# Altium schematic sheet CableNew.SchDoc
size A4
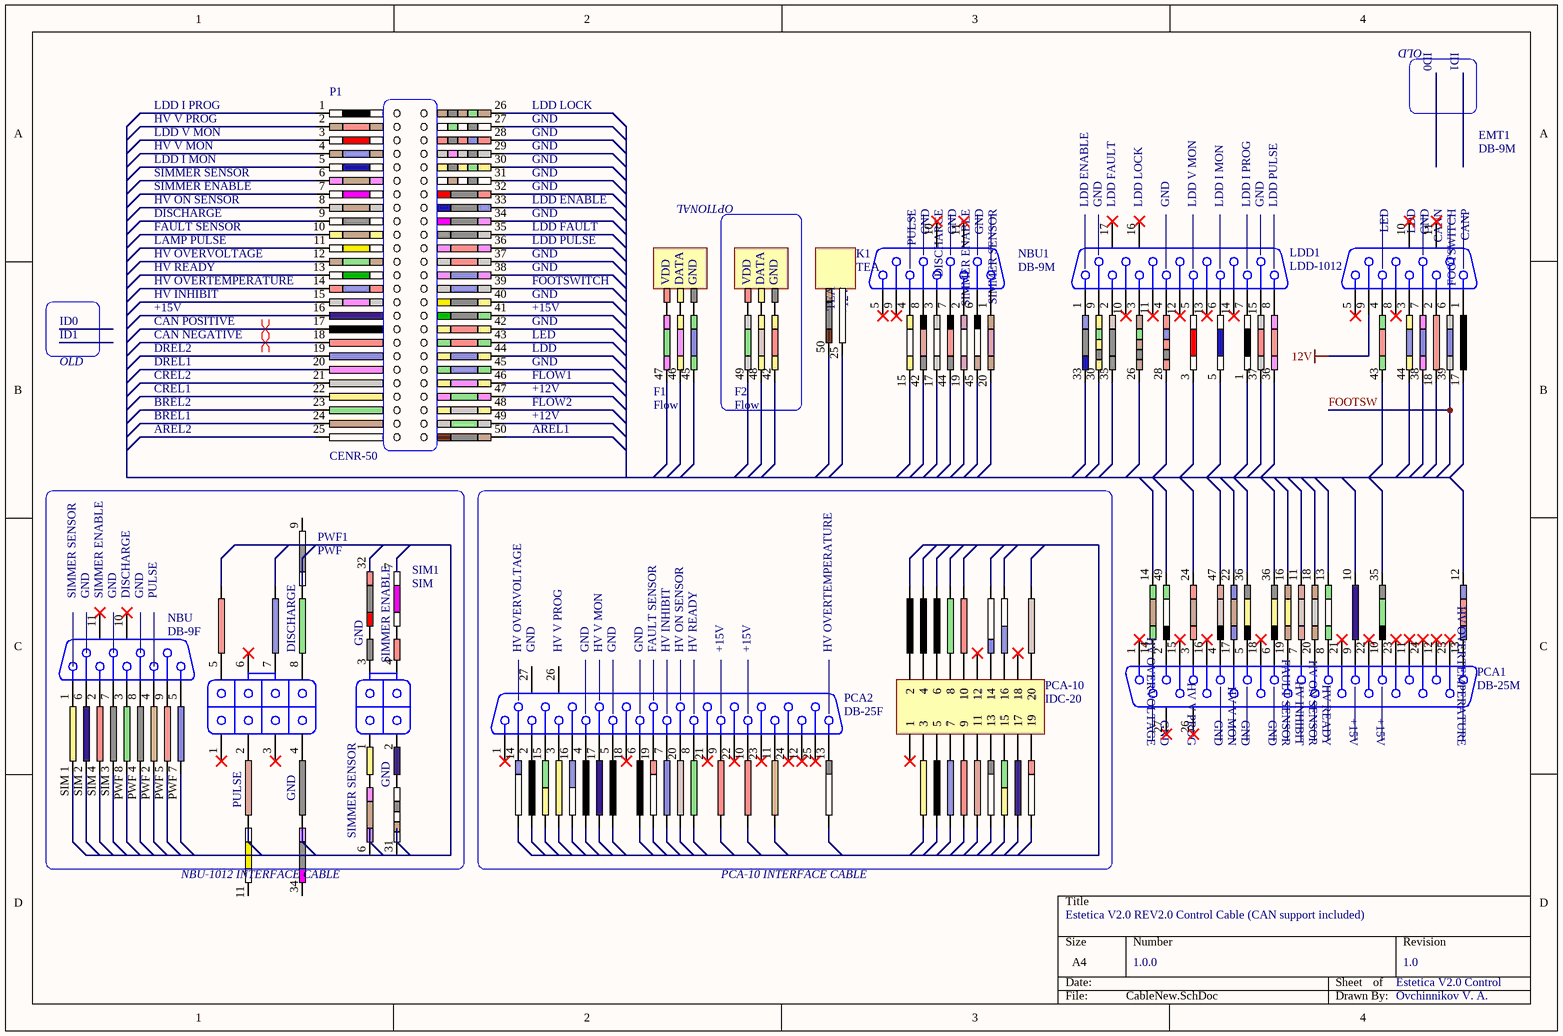
[diagram p0: CableNew.SchDoc]

## Parts
EMT1  DB-9M
F1  Flow
F2  Flow
K1  TEA
LDD1  LDD-1012
NBU  DB-9F
NBU1  DB-9M
P1  CENR-50
PCA1  DB-25M
PCA2  DB-25F
PCA-10  IDC-20
PWF1  PWF
SIM1  SIM

## Blocks framed on the sheet
OPTIONAL: F2

## Nets
12V: EMT1.9

Not connected (* = marked no-connect by the designer): EMT1 1 2 3 4 5* 6 7 8* 10(MH1)* 11(MH2)* 17 18 38 39 43 44; F1 45 46 47; F2 42 48 49; K1 25 50; LDD1 1 2 3 4 5 6 7 8 9 10* 11* 12* 13* 14* 15 16(MH1)* 17(MH2)* 26 28 30 33 35 36 37; NBU 1 2 3 4 5 6 7 8 9 10(MH1)* 11(MH2)* PWF 2 PWF 4 PWF 5 PWF 7 PWF 8 SIM 1 SIM 2 SIM 3 SIM 4; NBU1 1 2 3 4 5* 6 7 8 9* 10(MH1)* 11(MH2)* 15 17 19 20 42 44 45; P1 1 2 3 4 5 6 7 8 9 10 11 12 13 14 15 16 17 18 19 20 21 22 23 24 25 26 27 28 29 30 31 32 33 34 35 36 37 38 39 40 41 42 43 44 45 46 47 48 49 50; PCA1 1* 2 3 4 5 6 7 8 9 10 11 12 13 14 15* 16 17 18 19 20 21* 22 23* 24 25* 26(MH1)* 27(MH2)* 35 36 47 49; PCA2 1* 2 3 4 5 6 7 8 9 10 11 12* 13 14 15 16 17 18* 19 20 21* 22* 23* 24* 25* 26(MH1) 27(MH2) ?1 ?2 ?3 ?4 ?5 ?6 ?7 ?8 ?9 ?10 ?11 ?12 ?13 ?14 ?15 ?16 ?17; PCA-10 1* 2 3 4 5 6 7 8 9 10 11 12* 13 14 15 16 17 18* 19 20 ?1 ?2 ?3 ?4 ?5 ?6 ?7 ?8 ?9 ?10 ?11 ?12 ?13 ?14 ?15 ?16 ?17; PWF1 1* 2 3* 4 5 6* 7 8 9 11 34 ?1 ?2 ?3 ?4 ?5; SIM1 1 2 3 4 6 7 31 32 ?1 ?2 ?3 ?4

## Layout directives
differential pair: NetP1_17, NetP1_18

## Notes on the sheet
- OLD
- LDD I PROG
- (near P1) LDD LOCK
- ID0
- ID1
- SIMMER SENSOR
- LDD I MON
- HV V MON
- LDD V MON
- HV V PROG
- (near P1) GND
- LAMP PULSE
- FAULT SENSOR
- DISCHARGE
- HV ON SENSOR
- SIMMER ENABLE
- (near P1) LDD PULSE
- (near P1) LDD FAULT
- (near P1) LDD ENABLE
- (near LDD1) LDD ENABLE
- (near LDD1) GND
- (near LDD1) LDD FAULT
- (near LDD1) LDD LOCK
- (near LDD1) LDD V MON
- (near LDD1) LDD I MON
- (near LDD1) LDD I PROG
- (near LDD1) LDD PULSE
- HV INHIBIT
- HV OVERTEMPERATURE
- HV READY
- HV OVERVOLTAGE
- +15V
- (near P1) +15V
- (near P1) FOOTSWITCH
- CREL2
- DREL1
- DREL2
- CAN POSITIVE
- CAN NEGATIVE
- (near P1) FLOW1
- (near P1) LDD
- (near P1) LED
- AREL2
- BREL1
- BREL2
- CREL1
- (near P1) AREL1
- (near P1) +12V
- (near P1) FLOW2
- (near PCA2) HV OVERVOLTAGE
- (near PCA2) GND
- (near PCA2) HV V PROG
- (near PCA2) HV V MON
- (near PCA2) FAULT SENSOR
- (near PCA2) HV INHIBIT
- (near PCA2) HV ON SENSOR
- (near PCA2) HV READY
- (near PCA2) +15V
- (near PCA2) HV OVERTEMPERATURE
- (near PCA1) HV OVERVOLTAGE
- (near PCA1) GND
- (near PCA1) HV V PROG
- (near PCA1) HV V MON
- (near PCA1) FAULT SENSOR
- (near PCA1) HV INHIBIT
- (near PCA1) HV ON SENSOR
- (near PCA1) HV READY
- (near PCA1) +15V
- (near PCA1) HV OVERTEMPERATURE
- (near PWF1) NBU-1012 INTERFACE CABLE
- PCA-10 INTERFACE CABLE
- Estetica V2.0 REV2.0 Control Cable (CAN support included)
- 1.0.0
- Estetica V2.0 Control
- 1.0
- Ovchinnikov V. A.
- (in symbol Emmiter) LED; LDD; GND; CANN; FOOTSWITCH; CANP
- (in symbol Flow Sensor) VDD; DATA; GND
- (in symbol Flow Sensor 2) VDD; DATA; GND
- (in symbol NBU) PULSE; GND; DISCHARGE; SIMMER ENABLE; SIMMER SENSOR
- (in symbol NBU_1) SIMMER SENSOR; GND; SIMMER ENABLE; DISCHARGE; PULSE
- (in symbol PWF) DISCHARGE; GND; PULSE
- (in symbol SIM) GND; SIMMER ENABLE; SIMMER SENSOR
- (in symbol TEA) +12V

## Library data of the parts
EMT1 = Emmiter
F1 = Flow Sensor
F2 = Flow Sensor 2
K1 = TEA: Termo electrical assembly
NBU = NBU_1
NBU1 = NBU
P1 = CENR50: Laser Interface Cable
PCA1 = PCA-10_1
PCA2 = PCA-10_1_1
PCA-10 = PCA-10_1_1_1